# EAGLE design RPi breakout (EAGLE 6.5.0)
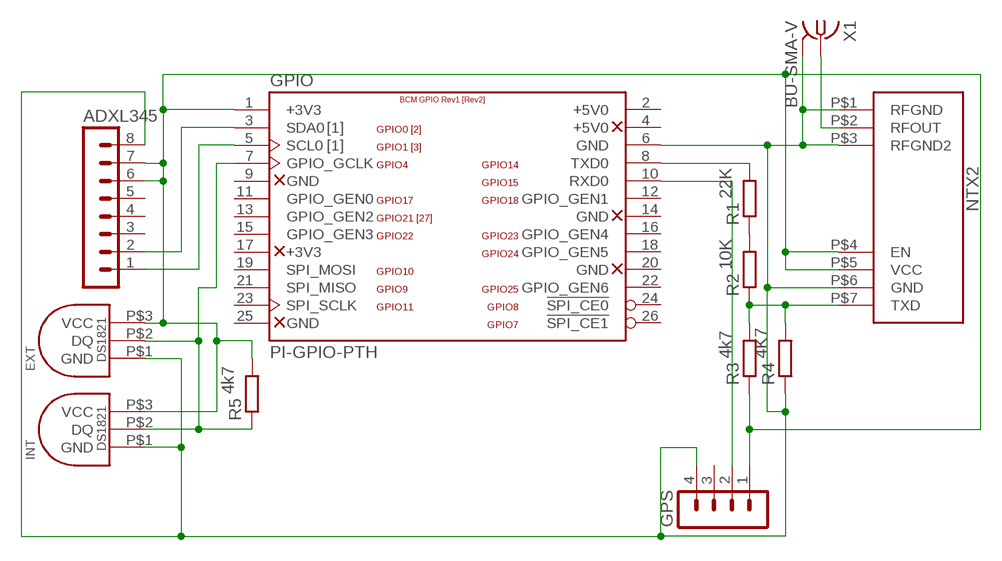
[diagram p0: schematic, sheet 1]

## Parts
ADXL345  MA08-1  [MA08-1]
EXT  DS1821  [DS1821]
GPIO  PI-GPIO-PTH  [GPIO-CONNECTOR]
GPS  MA04-1  [MA04-1]
INT  DS1821  [DS1821]
NTX2  NTX2  [NTX2]
R1  R-EU_0207/10  [0207/10]
R2  R-EU_0207/10  [0207/10]
R3  R-EU_0207/10  [0207/10]
R4  R-EU_0207/10  [0207/10]
R5  R-EU_0207/10  [0207/10]
X1  BU-SMA-V  [BU-SMA-V]

## Nets
+3V3: ADXL345.6 ADXL345.7 EXT.P$3(VCC) GPIO.1(+3V3) GPS.1 INT.P$3(VCC) NTX2.P$4(EN) NTX2.P$5(VCC) R3.1 R5.2
GND: ADXL345.8 EXT.P$1(GND) GPIO.6(GND) GPS.4 INT.P$1(GND) NTX2.P$1(RFGND) NTX2.P$3(RFGND2) NTX2.P$6(GND) R4.1 X1.2 X1.3 X1.4 X1.5
N$1: GPIO.10(RXD0) GPS.2
N$3: GPIO.8(TXD0) R1.2
N$4: NTX2.P$7(TXD) R2.1 R3.2 R4.2
N$5: NTX2.P$2(RFOUT) X1.1
N$6: R1.1 R2.2
N$7: ADXL345.1 GPIO.5(SCL0)
N$8: ADXL345.2 GPIO.3(SDA0)
N$23: EXT.P$2(DQ) GPIO.7(GPIO_GCLK) INT.P$2(DQ) R5.1
Unconnected: ADXL345.3 ADXL345.4 ADXL345.5 GPIO.4(+5V0) GPIO.9(GND) GPIO.11(GPIO_GEN0) GPIO.12(GPIO_GEN1) GPIO.13(GPIO_GEN2) GPIO.14(GND) GPIO.15(GPIO_GEN3) GPIO.16(GPIO_GEN4) GPIO.17(+3V3) GPIO.18(GPIO_GEN5) GPIO.19(SPI_MOSI) GPIO.20(GND) GPIO.21(SPI_MISO) GPIO.22(GPIO_GEN6) GPIO.23(SPI_SCLK) GPIO.24(!SPI_CE0) GPIO.25(GND) GPIO.26(!SPI_CE1) GPS.3

## Power pins joined to a net without a drawn wire
+5V0: GPIO.2(+5V0)

## Library data of the parts
ADXL345 = con-lstb:MA08-1: PIN HEADER; OC_FARNELL: unknown; OC_NEWARK: unknown
EXT INT = Pi weerballon:DS1821: Dallas Semiconductor Temp Sensor
GPIO = jt-raspberry-pi:PI-: Raspberry Pi
GPS = con-lstb:MA04-1: PIN HEADER; OC_FARNELL: unknown; OC_NEWARK: unknown
NTX2 = Pi weerballon:NTX2
R1 = rcl:R-EU_: RESISTOR, European symbol; R1: 22K
R2 = rcl:R-EU_: RESISTOR, European symbol; R1: 10K
R3 R5 = rcl:R-EU_: RESISTOR, European symbol; R3: 4k7
R4 = rcl:R-EU_: RESISTOR, European symbol; R2: 4K7
X1 = con-coax:BU-SMA-V: FEMALE SMA CONNECTOR Radiall distributor RS 112-3794; OC_FARNELL: unknown; OC_NEWARK: unknown

## Board
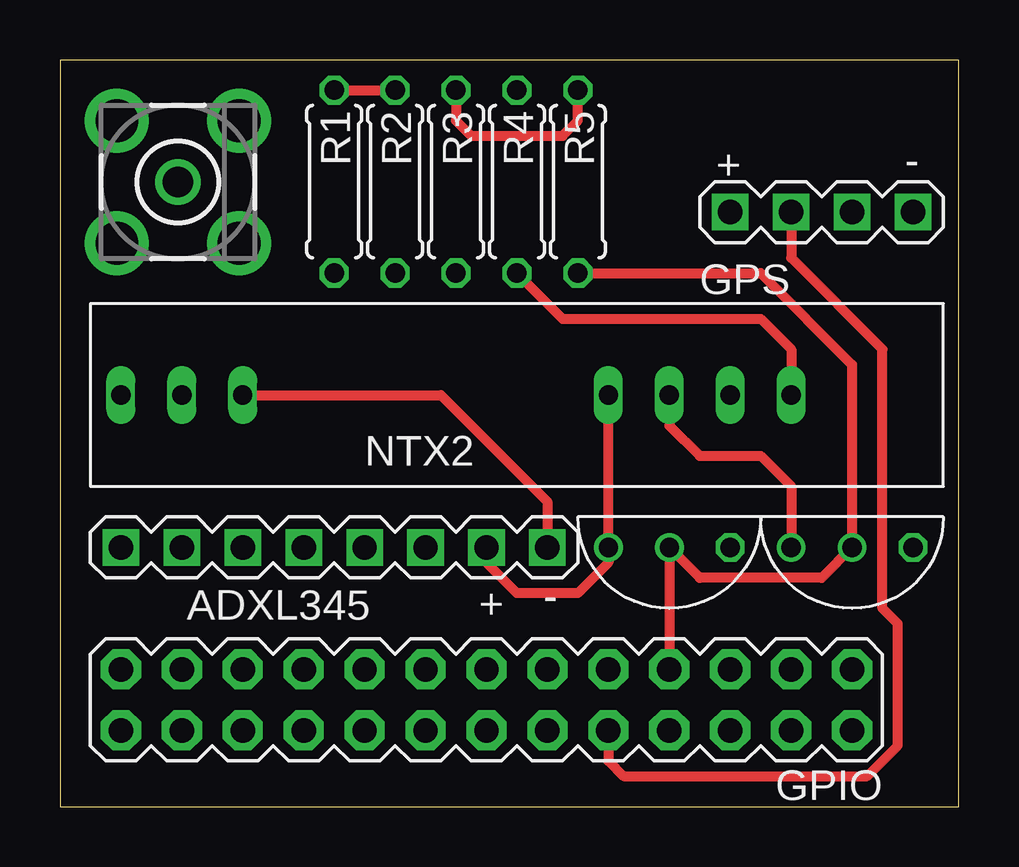
[diagram p1: board, top side]
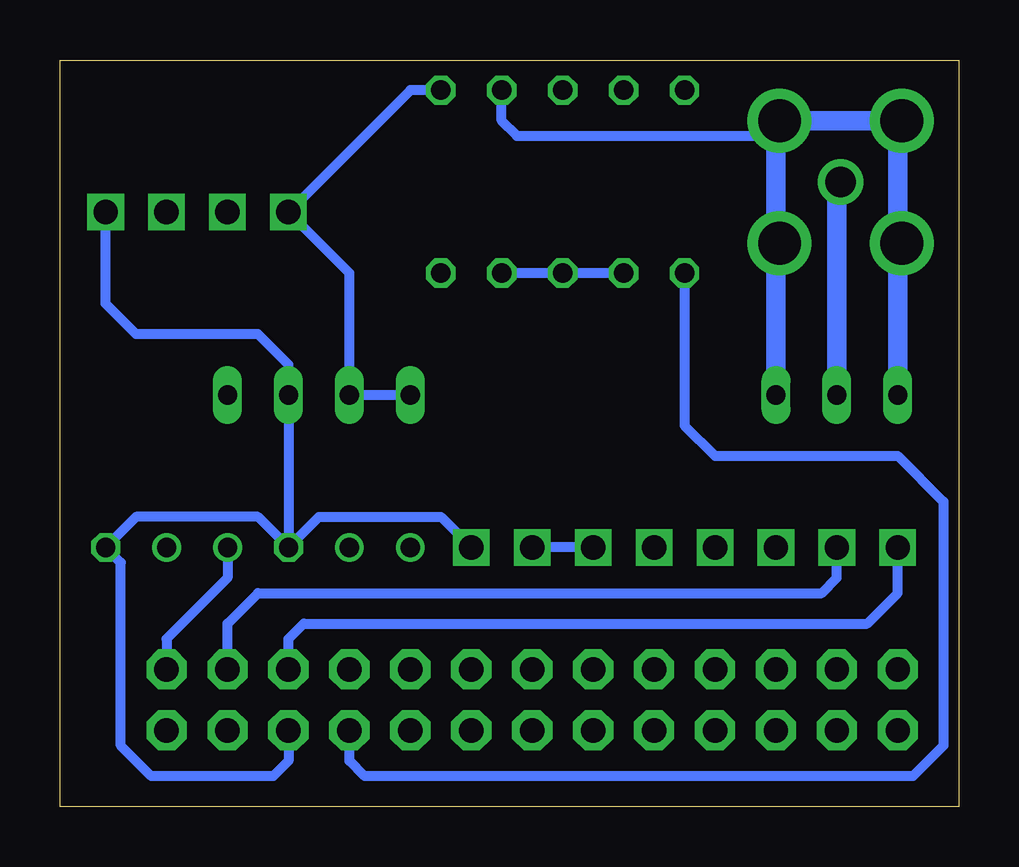
[diagram p2: board, bottom side, seen from below]

Size 37.47 x 31.1 mm. Coordinates in mm from the lower left corner, seen from the top.
Outline: 0,0 37.47,0 37.47,31.1 0,31.1 0,0
Copper layers (1*16): Top 0.0356mm / dielectric 1.5011mm / Bottom 0.0356mm
Design rules "LaenPCBOrder": minimum track width 6mil, minimum drill 13mil, track to track 6mil, track to pad 6mil, pad to pad 6mil, via to via 6mil, smd to smd 6mil, copper to edge 15mil, drill to drill 6mil, minimum pad ring 7mil, minimum via ring 7mil, stop-mask expansion 3mil, vias tented up to drill 0mil, thermal gap 10mil

### Footprints (pad centres in the part's own frame; a part is rotated, then mirrored left to right if it is on the bottom)
MA08-1 = drill 1.016 square: 1 -8.89,0; 2 -6.35,0; 3 -3.81,0; 4 -1.27,0; 5 1.27,0; 6 3.81,0; 7 6.35,0; 8 8.89,0
DS1821 = drill 0.8 octagon: P$1 -2.54,0 | drill 0.8: P$2 0,0; P$3 2.54,0
GPIO-CONNECTOR = drill 1.016 pad 1.676 octagon: 1 -15.24,-1.27; 2 -15.24,1.27; 3 -12.7,-1.27; 4 -12.7,1.27; 5 -10.16,-1.27; 6 -10.16,1.27; 7 -7.62,-1.27; 8 -7.62,1.27; 9 -5.08,-1.27; 10 -5.08,1.27; 11 -2.54,-1.27; 12 -2.54,1.27; 13 0,-1.27; 14 0,1.27; 15 2.54,-1.27; 16 2.54,1.27; 17 5.08,-1.27; 18 5.08,1.27; 19 7.62,-1.27; 20 7.62,1.27; 21 10.16,-1.27; 22 10.16,1.27; 23 12.7,-1.27; 24 12.7,1.27; 25 15.24,-1.27; 26 15.24,1.27
MA04-1 = drill 1.016 square: 1 -3.81,0; 2 -1.27,0; 3 1.27,0; 4 3.81,0
NTX2 = drill 0.8 long: P$1 -10.16,0; P$2 -7.62,0; P$3 -5.08,0; P$4 10.16,0; P$5 12.7,0; P$6 15.24,0; P$7 17.78,0
0207/10 = drill 0.813 octagon: 1 -3.81,0; 2 3.81,0
BU-SMA-V = drill 1.27: 1 0,0 | drill 1.778: 2 -2.55,2.55; 3 2.55,2.55; 4 2.55,-2.55; 5 -2.55,-2.55

### Placement (x,y rotation side)
ADXL345  11.43,10.79 0 top
EXT  25.4,10.79 180 top
GPIO  17.78,4.44 180 top
GPS  31.75,24.77 0 top
INT  33.02,10.79 180 top
NTX2  12.7,17.14 0 top
R1  11.43,26.04 270 top
R2  13.97,26.04 90 top
R3  16.51,26.04 270 top
R4  19.05,26.04 270 top
R5  21.59,26.04 90 top
X1  4.92,26.02 90 top

### Tracks (layer width: path | path; a pad name or v marks a point on that pad's centre or on a via)
+3V3
  Top 0.406: NTX2.P$5 25.4,15.88 26.67,14.61 29.21,14.61 30.48,13.34 INT.P$3 | NTX2.P$4 EXT.P$3 22.86,10.16 21.59,8.89 19.05,8.89 17.78,10.16 ADXL345.7 | R3.1 16.51,28.57 17.14,27.94 20.96,27.94 21.59,28.57 R5.2
  Bottom 0.406: ADXL345.6 ADXL345.7 | R5.2 22.86,29.84 GPS.1 25.4,22.22 NTX2.P$5 NTX2.P$4 | INT.P$3 30.48,9.53 33.02,6.99 GPIO.1
GND
  Top 0.406: NTX2.P$3 15.88,17.14 20.32,12.7 ADXL345.8
  Bottom 0.406: X1.2 2.37,17.32 NTX2.P$1 2.54,28.4 X1.3 X1.4 7.47,27.94 | NTX2.P$3 7.47,17.3 X1.5 7.47,27.94 | EXT.P$1 29.21,12.07 34.29,12.07 INT.P$1 34.93,10.16 34.93,2.54 33.66,1.27 28.57,1.27 27.94,1.91 GPIO.6 | 7.47,27.94 7.62,27.94 18.41,27.94 19.05,28.57 R4.1 | GPS.4 35.56,20.95 34.29,19.68 29.21,19.68 27.94,18.41 NTX2.P$6 EXT.P$1 | EXT.P$1 26.67,12.07 21.59,12.07 ADXL345.8
  Bottom 0.813: NTX2.P$3 7.62,27.94 7.62,28.57 2.54,28.57 NTX2.P$1
N$1
  Top 0.406: GPIO.10 22.86,1.91 23.5,1.27 33.66,1.27 34.93,2.54 34.93,7.62 34.29,8.26 34.29,19.05 30.48,22.86 GPS.2
N$3
  Bottom 0.406: R1.2 11.43,15.88 10.16,14.61 2.54,14.61 0.63,12.7 0.63,2.54 1.91,1.27 24.77,1.27 25.4,1.91 GPIO.8
N$4
  Top 0.406: R4.2 20.96,20.32 29.21,20.32 30.48,19.05 NTX2.P$7
  Bottom 0.406: R2.1 R3.2 R4.2
N$5
  Bottom 0.813: NTX2.P$2 5.08,25.86 X1.1
N$6
  Top 0.406: R1.1 R2.2
N$7
  Bottom 0.406: GPIO.5 27.94,6.99 27.3,7.62 3.81,7.62 2.54,8.89 ADXL345.1
N$8
  Bottom 0.406: GPIO.3 30.48,7.62 29.21,8.89 5.72,8.89 5.08,9.53 ADXL345.2
N$23
  Top 0.406: GPIO.7 EXT.P$2 26.67,9.53 31.75,9.53 INT.P$2 33.02,18.41 29.21,22.22 R5.1